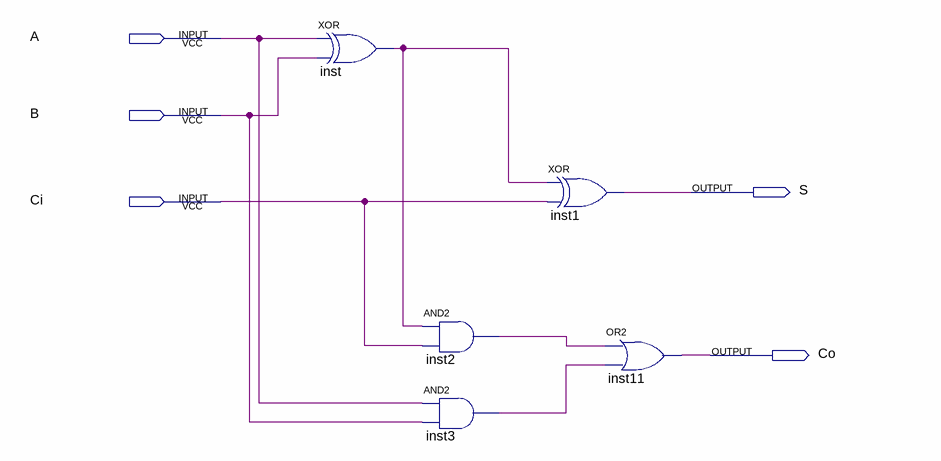
[diagram p0: schematic sheet]
// Quartus schematic full_adder.bdf as structural Verilog: 5 symbols, 5 pins
module full_adder (
  input  A,
  input  B,
  input  Ci,
  output S,
  output Co
);

  wire inst2_out, inst3_out, inst_out;

  xor inst (inst_out, A, B);
  and inst2 (inst2_out, inst_out, Ci);
  and inst3 (inst3_out, A, B);
  xor inst1 (S, inst_out, Ci);
  or inst11 (Co, inst2_out, inst3_out);
endmodule
